# EAGLE design USBasp_SMD (EAGLE 7.7.0)
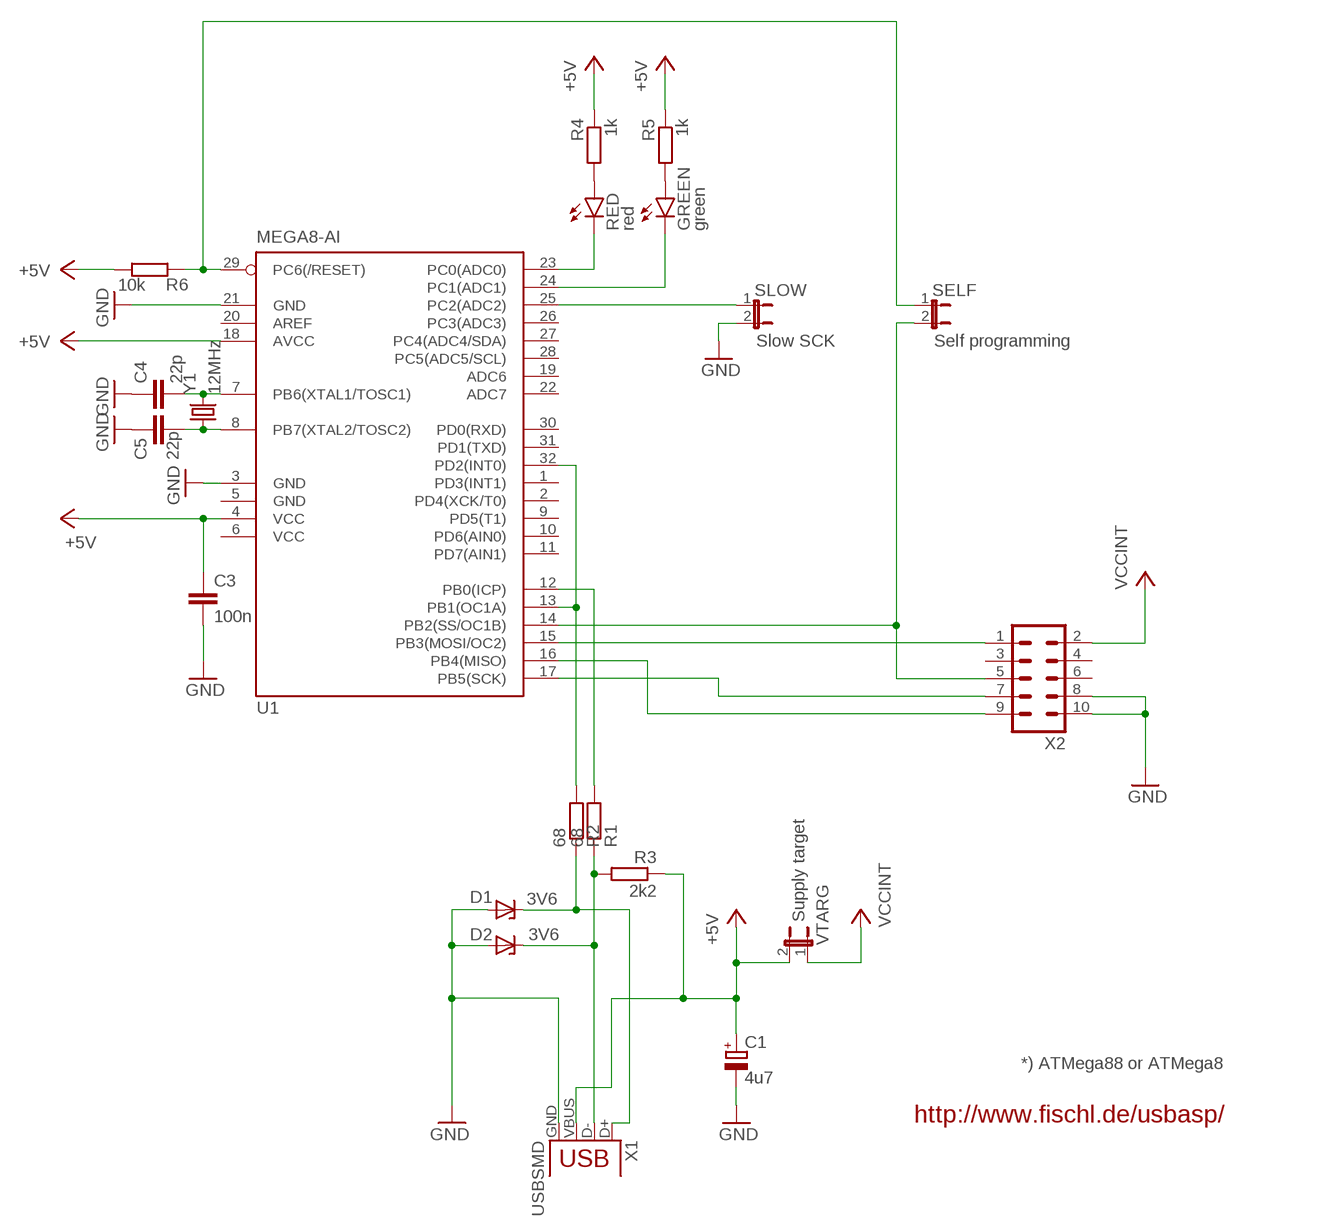
[diagram p0: schematic, sheet 1]

## Parts
C1  4u7  CPOL-EUE2.5-5  [E2,5-5]
C3  100n  C-EUC1206  [C1206]
C4  22p  C-EUC1206  [C1206]
C5  22p  C-EUC1206  [C1206]
D1  3V6  ZENER-DIODEDO34-7  [DO34Z7]
D2  3V6  ZENER-DIODEDO34-7  [DO34Z7]
GREEN  green  LED1206  [LED-1206]
R1  68  R-EU_M1206  [M1206]
R2  68  R-EU_M1206  [M1206]
R3  2k2  R-EU_M1206  [M1206]
R4  1k  R-EU_M1206  [M1206]
R5  1k  R-EU_M1206  [M1206]
R6  10k  R-EU_M1206  [M1206]
RED  red  LED1206  [LED-1206]
SELF  Self programming  JP1E  [JP1]
SLOW  Slow SCK  JP1E  [JP1]
U1  MEGA8-AI  [TQFP32-08]
VTARG  Supply target  JP1E  [JP1]
X1  USBSMD  [USB-MINIB]
X2  ML10L  [ML10L]
Y1  12MHz  CRYSTALSMD  [HC49UP]

## Nets
+5V: C1.+ C3.1 R3.1 R4.1 R5.1 R6.1 U1.4(VCC) U1.18(AVCC) VTARG.2 X1.VBUS
GND: C1.- C3.2 C4.1 C5.1 D1.A D2.A SLOW.2 U1.3(GND) U1.21(GND) X1.GND X2.8 X2.10
N$1: R6.2 SELF.1 U1.29(PC6(/RESET))
N$2: SELF.2 U1.14(PB2(SS/OC1B)) X2.5
N$3: U1.15(PB3(MOSI/OC2)) X2.1
N$4: U1.17(PB5(SCK)) X2.7
N$5: D2.C R1.1 R3.2 X1.D-
N$6: U1.16(PB4(MISO)) X2.9
N$7: D1.C R2.1 X1.D+
N$10: R2.2 U1.13(PB1(OC1A)) U1.32(PD2(INT0))
N$11: R1.2 U1.12(PB0(ICP))
N$12: SLOW.1 U1.25(PC2(ADC2))
N$13: R4.2 RED.A
N$14: RED.C U1.23(PC0(ADC0))
N$15: GREEN.C U1.24(PC1(ADC1))
N$22: C4.2 U1.7(PB6(XTAL1/TOSC1)) Y1.2
N$23: C5.2 U1.8(PB7(XTAL2/TOSC2)) Y1.1
N$25: GREEN.A R5.2
VCCINT: VTARG.1 X2.2
Unconnected: U1.1(PD3(INT1)) U1.2(PD4(XCK/T0)) U1.9(PD5(T1)) U1.10(PD6(AIN0)) U1.11(PD7(AIN1)) U1.19(ADC6) U1.20(AREF) U1.22(ADC7) U1.26(PC3(ADC3)) U1.27(PC4(ADC4/SDA)) U1.28(PC5(ADC5/SCL)) U1.30(PD0(RXD)) U1.31(PD1(TXD)) X2.3 X2.4 X2.6

## Notes on the sheet
- *) ATMega88 or ATMega8
- http://www.fischl.de/usbasp/

## Power pins joined to a net without a drawn wire
GND: U1.5(GND)
VCC: U1.6(VCC)

## Library data of the parts
C1 = rcl:CPOL-EU: POLARIZED CAPACITOR, European symbol
C3-C5 = rcl:C-EU: CAPACITOR, European symbol
D1 D2 = diode:ZENER-DIODE: Z-Diode
GREEN RED = SparkFun-LED:LED: LEDs Standard schematic elements and footprints for 5mm, 3mm, 1206, and 0603 sized LEDs. 5mm - Spark Fun Electronics SKU : COM-00529 (and others)
R1-R6 = rcl:R-EU_: RESISTOR, European symbol
SELF SLOW VTARG = jumper:JP1E: JUMPER
U1 = atmel:MEGA8: MICROCONTROLLER 8 Kbytes FLASH, 1 kbytes SRAM, 512 bytes EEPROM, USART, 6-channel 10 bit ADC, 2-channel 8 bit ADC Pin compatible with Atmega48, ATMega88, ATMega168 Source: avr.lbr; MPN: ATMEGA8-16AU; OC_FARNELL: 9171371; OC_NEWARK: 73M8863
X1 = SparkFun-Connectors:USB: USB Connectors USB-B-PTH is fully proven SKU : PRT-00139/CONN-08278 USB-miniB is fully proven SKU : PRT-00587 USB-A-PCB is untested. USB-A-H is throughly reviewed, but untested. Spark Fun Electronics SKU : PRT-00437 USB-B-SMT is throughly reviewed, but untested. Needs silkscreen touching up. USB-A-S has not been used/tested USB-MB-H has not been used/tested USB-MICROB has been used. CONN-09505; PROD_ID: CONN-08193
X2 = con-harting-ml:ML10: HARTING
Y1 = SparkFun-FreqCtrl:CRYSTAL: Various standard crystals. Proven footprints.

## Board
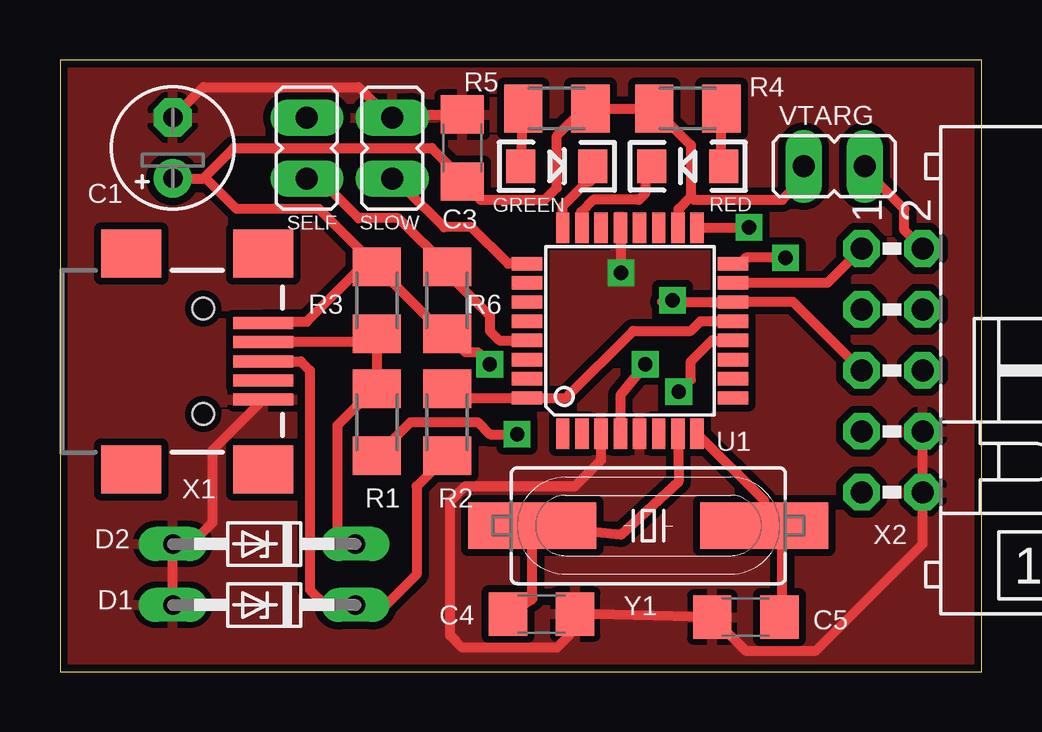
[diagram p1: board, top side]
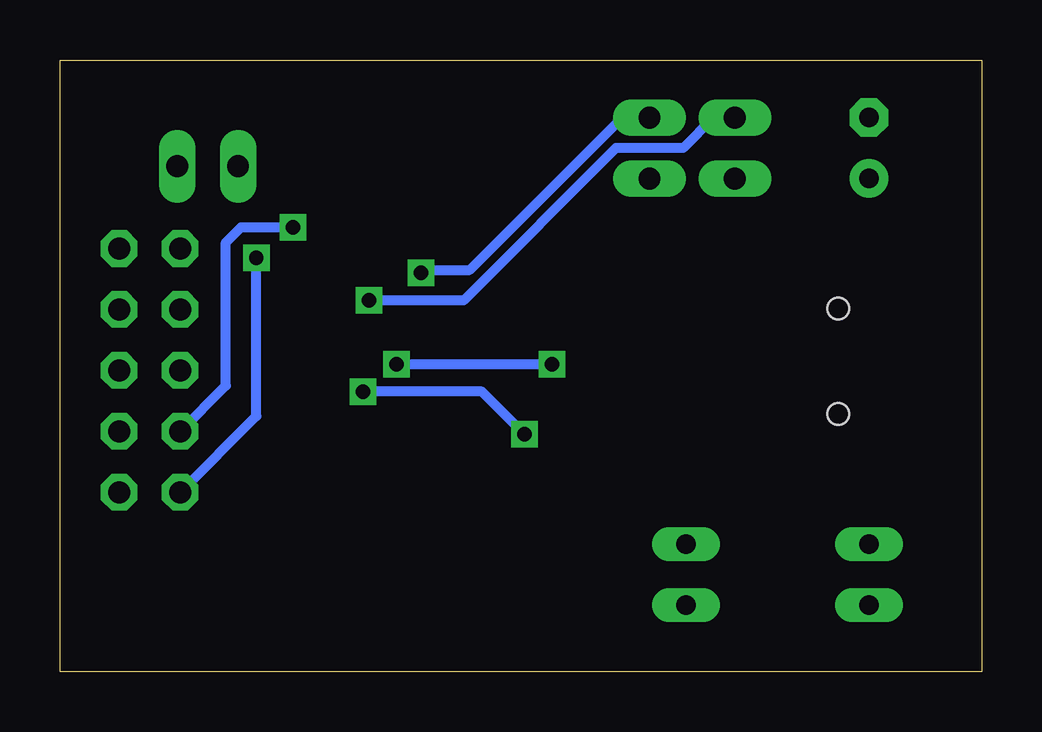
[diagram p2: board, bottom side, seen from below]

Size 38.41 x 25.52 mm. Coordinates in mm from the lower left corner, seen from the top.
Outline: 0,0 38.41,0 38.41,25.52 0,25.52 0,0
Copper layers (1*16): Top 0.035mm / dielectric 1.5mm / Bottom 0.035mm
Design rules "SparkFun": minimum track width 8mil, minimum drill 20mil, track to track 8mil, track to pad 8mil, pad to pad 8mil, via to via 8mil, smd to smd 8mil, copper to edge 8mil, drill to drill 8mil, minimum pad ring 12mil, minimum via ring 10mil, stop-mask expansion 4mil, vias tented up to drill 20mil, thermal gap 10mil

### Footprints (pad centres in the part's own frame; a part is rotated, then mirrored left to right if it is on the bottom)
E2,5-5 = drill 0.813 pad 1.6: + -1.27,0 | drill 0.813 pad 1.6 octagon: - 1.27,0
C1206 = smd 1.6 x 1.8: 1 -1.4,0; 2 1.4,0
DO34Z7 = drill 0.813 long: A 3.81,0; C -3.81,0
LED-1206 = smd 1.2 x 1.4: A -1.5,0; C 1.5,0
M1206 = smd 1.6 x 2: 1 -1.4,0; 2 1.4,0
JP1 = drill 0.914 long: 1 0,-1.27; 2 0,1.27
TQFP32-08 = smd 1.27 x 0.559: 1 -4.293,2.8; 2 -4.293,2; 3 -4.293,1.2; 4 -4.293,0.4; 5 -4.293,-0.4; 6 -4.293,-1.2; 7 -4.293,-2; 8 -4.293,-2.8; 17 4.293,-2.8; 18 4.293,-2; 19 4.293,-1.2; 20 4.293,-0.4; 21 4.293,0.4; 22 4.293,1.2; 23 4.293,2; 24 4.293,2.8 | smd 0.559 x 1.27: 9 -2.8,-4.293; 10 -2,-4.293; 11 -1.2,-4.293; 12 -0.4,-4.293; 13 0.4,-4.293; 14 1.2,-4.293; 15 2,-4.293; 16 2.8,-4.293; 25 2.8,4.293; 26 2,4.293; 27 1.2,4.293; 28 0.4,4.293; 29 -0.4,4.293; 30 -1.2,4.293; 31 -2,4.293; 32 -2.8,4.293
USB-MINIB = smd 2.5 x 0.5: D+ 2.5,0; D- 2.5,0.8; GND 2.5,-1.6; ID 2.5,-0.8; VBUS 2.5,1.6 | smd 2.5 x 2: MTN1 -3,4.5; MTN2 2.5,4.5; MTN3 -3,-4.5; MTN4 2.5,-4.5 | hole 0.9: 0,2.2; 0,-2.2
ML10L = drill 0.914 octagon: 1 -5.08,-1.27; 2 -5.08,1.27; 3 -2.54,-1.27; 4 -2.54,1.27; 5 0,-1.27; 6 0,1.27; 7 2.54,-1.27; 8 2.54,1.27; 9 5.08,-1.27; 10 5.08,1.27
HC49UP = smd 5.334 x 1.93: 1 -4.826,0; 2 4.826,0

### Placement (x,y rotation side)
C1  4.7,21.84 90 top
C3  16.76,21.84 90 top
C4  20.07,2.41 180 top
C5  28.57,2.29 0 top
D1  8.51,2.79 180 top
D2  8.51,5.33 180 top
GREEN  20.7,21.08 0 top
R1  13.21,10.41 270 top
R2  16.13,10.41 90 top
R3  13.21,15.49 270 top
R4  26.16,23.5 0 top
R5  20.7,23.5 180 top
R6  16.13,15.49 90 top
RED  26.16,21.08 180 top
SELF  10.29,21.84 0 top
SLOW  13.84,21.84 0 top
U1  23.75,14.22 90 top
VTARG  32.26,21.08 90 top
X1  5.97,12.95 0 top
X2  34.67,12.57 270 top
Y1  24.51,6.1 180 top

### Tracks (layer width: path | path; a pad name or v marks a point on that pad's centre or on a via)
+5V  (via drill 0.6)
  Top 0.406: R3.1 16.01,14.09 R6.1 16.89,13.34 17.4,13.34 v17.91,12.83 | X1.VBUS 8.52,14.61 10.29,14.61 12.58,16.89 R3.1 | 22.61,23.24 R5.1 | R5.1 R4.1 26.29,21.97 26.29,19.81 | 25.78,19.18 25.78,19.3 26.29,19.81 | 25.78,19.18 25.75,19.14 U1.18 25.78,18.55 25.78,19.18 | 26.29,19.81 26.42,19.68 30.1,19.68 30.86,20.45 VTARG.2 | R5.1 21.84,23.5 20.7,22.35 20.7,20.19 20.19,19.68 17.52,19.68 C3.1 16.76,20.57 15.49,21.84 7.24,21.84 5.97,20.57 | v24.38,12.83 23.35,11.54 U1.4 | C1.+ 5.97,20.57 | R3.1 10.8,19.3 7.37,19.3 6.1,20.57 5.97,20.57
  Bottom 0.406: v17.91,12.83 v24.38,12.83
GND  (via drill 0.6)
  Top 0.406: X2.8 X2.10 35.94,5.33 31.5,0.89 28.57,0.89 C5.1 C4.1 21.21,2.16 21.21,1.52 20.7,1.02 16.76,1.02 16.26,1.52 16.26,7.11 16.89,7.75 21.46,7.75 22.55,8.83 U1.3 | D1.A D2.A 5.46,5.33 6.35,6.22 6.35,9.23 X1.GND | C3.2 14.35,23.24 SLOW.2 13.72,23.11 12.45,24.38 5.97,24.38 C1.- | U1.21 23.37,18.5 v23.37,16.64
  Bottom 0.406: v23.37,16.64 23.24,16.76 21.34,16.76 14.99,23.11 SLOW.2
  pour Top (isolate 0.305): 0,0 38.35,0 38.35,0.13 38.35,25.53 0,25.53 0,25.4
N$1
  Top 0.406: U1.29 18.31,13.82 17.91,14.22 17.91,14.86 16.13,16.64 R6.2 14.1,18.92 12.45,18.92 11.18,20.19 SELF.1
N$2  (via drill 0.6)
  Top 0.406: X2.5 30.55,15.42 U1.14 25.09,15.42 v25.53,15.49
  Bottom 0.406: SELF.2 11.18,23.11 12.45,21.84 15.24,21.84 21.59,15.49 v25.53,15.49
N$3
  Top 0.406: X2.1 31.97,16.22 U1.15
N$4  (via drill 0.6)
  Top 0.406: v28.7,18.54 28.68,18.52 U1.17
  Bottom 0.406: X2.7 31.5,11.94 31.5,17.91 30.86,18.54 v28.7,18.54
N$5
  Top 0.406: X1.D- 13.12,13.75 13.59,14.22 13.34,14.22 R3.2 R1.1 13.08,11.81 11.56,10.29 11.56,5.97 12.19,5.33 D2.C
N$6  (via drill 0.6)
  Top 0.406: v30.23,17.27 28.57,17.27 28.33,17.02 U1.16
  Bottom 0.406: X2.9 30.23,10.67 v30.23,17.27
N$7
  Top 0.406: R2.1 14.86,7.74 14.86,4.06 13.59,2.79 D1.C 11.05,2.79 10.41,3.43 10.41,12.57 10.03,12.95 X1.D+
N$10
  Top 0.406: R2.2 16.52,11.42 U1.32 21.08,11.43 23.88,14.22 26.29,14.22 26.69,14.62 U1.13
N$11  (via drill 0.6)
  Top 0.406: R1.2 14.61,10.41 17.4,10.41 17.91,9.91 v19.05,9.91 | U1.12 27.16,13.82 26.29,12.95 26.29,12.19 v25.78,11.68
  Bottom 0.406: v19.05,9.91 20.83,11.68 v25.78,11.68
N$12
  Top 0.406: U1.25 18.67,17.02 17.14,18.54 16,18.54 14.35,20.19 SLOW.1
N$13
  Top 0.406: RED.A 27.56,21.11 27.56,23.11 27.56,23.12 R4.2
N$14
  Top 0.406: RED.C 24.38,20.73 24.38,19.94 24.13,19.68 22.23,19.68 21.72,19.18 21.75,19.14 U1.23
N$15
  Top 0.406: U1.24 20.95,19.43 21.97,20.45 22.1,20.45 22.12,20.47 GREEN.C
N$22
  Top 0.406: Y1.2 19.81,6.6 | C4.2 19.68,3.05 Y1.2 | U1.7 25.78,7.94 23.37,5.71 Y1.2
N$23
  Top 0.406: U1.8 29.34,7.14 Y1.1 30.1,5.33 30.1,2.16 C5.2
N$25
  Top 0.406: R5.2 19.28,23.47 GREEN.A
VCCINT
  Top 0.406: X2.2 35.18,18.41 35.18,19.3 34.04,20.45 VTARG.1